# EAGLE design Solar_Charger (EAGLE 9.6.2)
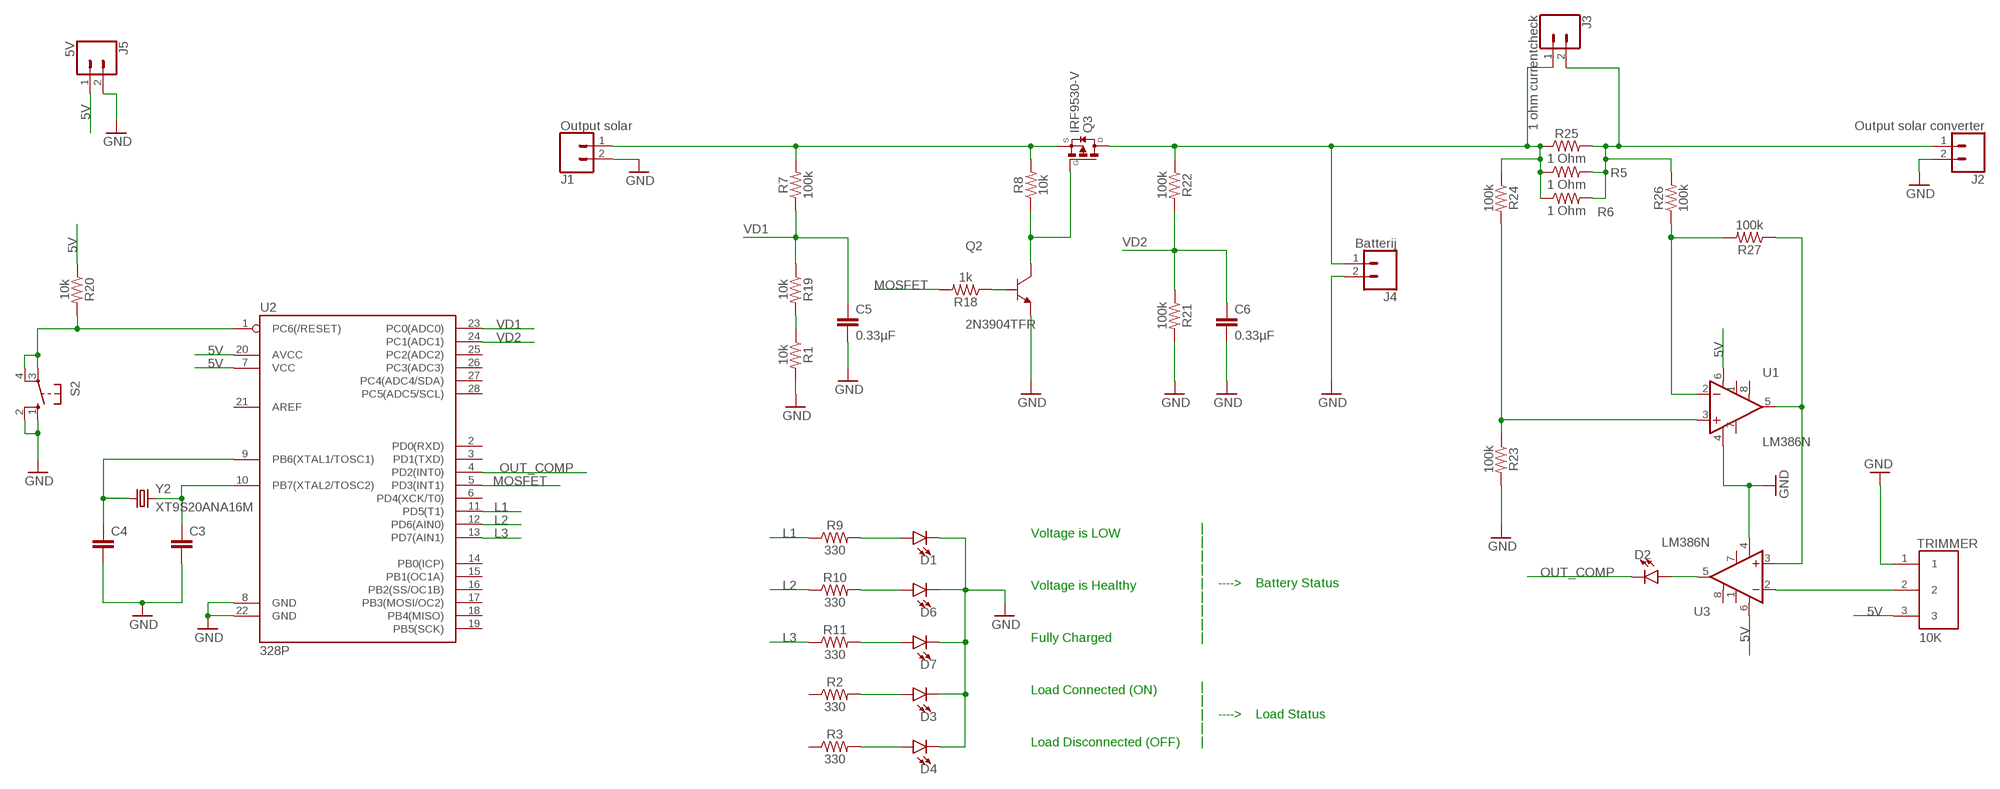
[diagram p0: schematic, sheet 1]

## Parts
C3  C2.5/5  [C2.5-5]
C4  C2.5/5  [C2.5-5]
C5  0.33µF  C2.5/5  [C2.5-5]
C6  0.33µF  C2.5/5  [C2.5-5]
D1  LED-3MM-NO_SILK  [LED_3MM-NS]
D2  LED-3MM-NO_SILK  [LED_3MM-NS]
D3  LED-3MM-NO_SILK  [LED_3MM-NS]
D4  LED-3MM-NO_SILK  [LED_3MM-NS]
D6  LED-3MM-NO_SILK  [LED_3MM-NS]
D7  LED-3MM-NO_SILK  [LED_3MM-NS]
J1  Output solar  CONN_02  [1X02]
J2  Output solar converter  CONN_02  [1X02]
J3  1 ohm currentcheck  CONN_02  [1X02]
J4  Batterij  CONN_02  [1X02]
J5  5V  CONN_02  [1X02]
Q2  2N3904TFR  [TO92254P520H877-3]
Q3  IRF9530-V  [TO220V]
R1  10k  1MOHM-HORIZ-1/4W-5%  [AXIAL-0.3]
R2  330  1KOHM-HORIZ-1/4W-1%  [AXIAL-0.3]
R3  330  1KOHM-HORIZ-1/4W-1%  [AXIAL-0.3]
R5  1 Ohm  1MOHM-HORIZ-1/4W-5%  [AXIAL-0.3]
R6  1 Ohm  1MOHM-HORIZ-1/4W-5%  [AXIAL-0.3]
R7  100k  1MOHM-HORIZ-1/4W-5%  [AXIAL-0.3]
R8  10k  1MOHM-HORIZ-1/4W-5%  [AXIAL-0.3]
R9  330  1KOHM-HORIZ-1/4W-1%  [AXIAL-0.3]
R10  330  1KOHM-HORIZ-1/4W-1%  [AXIAL-0.3]
R11  330  1KOHM-HORIZ-1/4W-1%  [AXIAL-0.3]
R18  1k  1MOHM-HORIZ-1/4W-5%  [AXIAL-0.3]
R19  10k  1MOHM-HORIZ-1/4W-5%  [AXIAL-0.3]
R20  10k  1MOHM-HORIZ-1/4W-5%  [AXIAL-0.3]
R21  100k  1MOHM-HORIZ-1/4W-5%  [AXIAL-0.3]
R22  100k  1MOHM-HORIZ-1/4W-5%  [AXIAL-0.3]
R23  100k  1MOHM-HORIZ-1/4W-5%  [AXIAL-0.3]
R24  100k  1MOHM-HORIZ-1/4W-5%  [AXIAL-0.3]
R25  1 Ohm  1MOHM-HORIZ-1/4W-5%  [AXIAL-0.3]
R26  100k  1MOHM-HORIZ-1/4W-5%  [AXIAL-0.3]
R27  100k  1MOHM-HORIZ-1/4W-5%  [AXIAL-0.3]
S2  10-XX  [B3F-10XX]
TRIMMER  10K  404806347006  [TRIM_404806347006]
U1  LM386N  LM386  [DIP08]
U2  328P  ATMEGA328P_PDIP  [DIP28]
U3  LM386N  LM386  [DIP08]
Y2  XT9S20ANA16M  [XTAL_XT9S20ANA16M]

## Nets
5V: J5.1 R20.P$1 TRIMMER.3 U1.6(V+) U2.7(VCC) U2.20(AVCC) U3.6(V+)
GND: C3.2 C4.2 C5.2 C6.2 D1.K(C) D3.K(C) D4.K(C) D6.K(C) D7.K(C) J1.2 J2.2 J4.2 J5.2 Q2.1(E) R1.P$2 R21.P$2 R23.P$2 S2.1(S) S2.2(S1) TRIMMER.1 U1.4(V-) U2.8(GND) U2.22(GND) U3.4(V-)
GND1: R20.P$2 S2.3(P) S2.4(P1) U2.1(PC6(/RESET))
L1: R9.P$1 U2.11(PD5(T1))
L2: R10.P$1 U2.12(PD6(AIN0))
L3: R11.P$1 U2.13(PD7(AIN1))
MOSFET: R18.P$2 U2.5(PD3(INT1))
N$1: J1.1 Q3.3(S) R7.P$2 R8.P$2
N$2: D3.A R2.P$2
N$3: D4.A R3.P$2
N$4: R23.P$1 R24.P$2 U1.3(+IN)
N$5: R26.P$1 R27.P$2 U1.2(-IN)
N$7: R1.P$1 R19.P$2
N$9: C4.1 U2.9(PB6(XTAL1/TOSC1)) Y2.1
N$10: C3.1 U2.10(PB7(XTAL2/TOSC2)) Y2.2
N$11: Q2.2(B) R18.P$1
N$12: Q2.3(C) Q3.1(G) R8.P$1
N$16: J3.1 J4.1 Q3.2(D) R5.P$1 R6.P$1 R22.P$1 R24.P$1 R25.P$1
N$20: R27.P$1 U1.5(OUT) U3.3(+IN)
N$22: TRIMMER.2 U3.2(-IN)
N$23: D2.A U3.5(OUT)
N$28: J2.1 J3.2 R5.P$2 R6.P$2 R25.P$2 R26.P$2
N$30: D1.A R9.P$2
N$31: D6.A R10.P$2
N$32: D7.A R11.P$2
OUT_COMP: D2.K(C) U2.4(PD2(INT0))
VD1: C5.1 R7.P$1 R19.P$1 U2.23(PC0(ADC0))
VD2: C6.1 R21.P$1 R22.P$2 U2.24(PC1(ADC1))
Unconnected: R2.P$1 R3.P$1 U1.1(GAIN) U1.7(BP) U1.8(GAIN) U2.2(PD0(RXD)) U2.3(PD1(TXD)) U2.6(PD4(XCK/T0)) U2.14(PB0(ICP)) U2.15(PB1(OC1A)) U2.16(PB2(SS/OC1B)) U2.17(PB3(MOSI/OC2)) U2.18(PB4(MISO)) U2.19(PB5(SCK)) U2.21(AREF) U2.25(PC2(ADC2)) U2.26(PC3(ADC3)) U2.27(PC4(ADC4/SDA)) U2.28(PC5(ADC5/SCL)) U3.1(GAIN) U3.7(BP) U3.8(GAIN)

## Notes on the sheet
- Voltage is LOW
- Voltage is Healthy
- Fully Charged
- |
  |
  |
  |
  |    ---->    Battery Status
  |
  |
  |
  |
- Load Connected (ON)
- Load Disconnected (OFF)
- |
  |
  |    ---->    Load Status
  |
  |

## Library data of the parts
C3-C6 = capacitor-wima:C: CAPACITOR naming: grid - package width
D1-D4 D6 D7 = SparkFun-LED:LED: LED (Generic) Standard schematic elements and footprints for 5mm, 3mm, 1206, and 0603 sized LEDs. Generic LEDs with no color specified.
J1-J5 = SparkFun-Connectors:CONN_02: Multi connection point. Often used as Generic Header-pin footprint for 0.1 inch spaced/style header connections On any of the 0.1 inch spaced packages, you can populate with these: Break Away Headers - Straight <https://www.sparkfun.com/products/116> (PRT-00116) Break Away Male Headers - Right Angle <https://www.sparkfun.com/products/553> (PRT-00553) Female Headers <https://www.sparkfun.com/products/115> (PRT-00115) Break Away Headers - Machine Pin <https://www.sparkfun.com/products/117> (PRT-00117) Break Away Female Headers - Swiss Machine Pin <https://www.sparkfun.com/products/743> (PRT-00743) For SCREWTERMINALS and SPRING TERMINALS visit here: Screw Terimnals on SparkFun.com <https://www.sparkfun.com/search/results?term=Screw+Terminals> (5mm/3.5mm/2.54mm spacing) This device is also useful as a general connection point to wire up your design to another part of your project. Our various solder wires solder well into these plated through hole pads. Hook-Up Wire - Assortment (Stranded, 22 AWG) <https://www.sparkfun.com/products/11375> (PRT-11375) Hook-Up Wire - Assortment (Solid Core, 22 AWG) <https://www.sparkfun.com/products/11367> (PRT-11367) View the entire wire category on our website here <https://www.sparkfun.com/categories/141> Special notes: Molex polarized connector foot print use with: PRT-08233 with associated crimp pins and housings. 2.54_SCREWTERM for use with PRT-10571. 3.5mm Screw Terminal footprints for PRT-08084 5mm Screw Terminal footprints for use with PRT-08432
Q2 = 2N3904TFR:2N3904TFR: Transistor General Purpose BJT NPN 40 Volt 0.2 Amp 3-Pin TO-92 Tape And Reel; AVAILABILITY: Unavailable; DESCRIPTION: Transistor General Purpose BJT NPN 40 Volt 0.2 Amp 3-Pin TO-92 Tape And Reel; MF: ON Semiconductor; MP: 2N3904TFR; PACKAGE: TO-92 ON Semiconductor; PRICE: None
Q3 = IRF9530:IRF9530: P-Channel MOSFET (HEXFET); -100V; -12A; 0,3Ohm; AVAILABILITY: Unavailable; DESCRIPTION: Trans MOSFET P-CH 100V 12A 3-Pin_3+Tab_ TO-220AB; MF: Vishay; MP: IRF9530; PACKAGE: TO-220 Intersil; PRICE: None
R1 R5-R8 R18-R27 = SparkFun-Resistors:1MOHM: 1MΩ resistor A resistor is a passive two-terminal electrical component that implements electrical resistance as a circuit element. Resistors act to reduce current flow, and, at the same time, act to lower voltage levels within circuits. - Wikipedia; PROD_ID: RES-09329; VALUE: 1M
R2 R3 R9-R11 = SparkFun-Resistors:1KOHM: 1kΩ resistor A resistor is a passive two-terminal electrical component that implements electrical resistance as a circuit element. Resistors act to reduce current flow, and, at the same time, act to lower voltage levels within circuits. - Wikipedia; PROD_ID: RES-12182; VALUE: 1k
S2 = switch-omron:10-XX: OMRON SWITCH; MPN: B3F-1000; OC_FARNELL: 176432; OC_NEWARK: 36M3542
TRIMMER = 404806347006:404806347006: Res Cermet Trimmer 500 Ohm 10% 1/2W 1Turn Pin Thru-Hole; AVAILABILITY: Unavailable; COMMENT: 1623831-6; DESCRIPTION: Res Cermet Trimmer 500 Ohm 10% 1/2W 1Turn Pin Thru-Hole; MF: TE Connectivity; MP: 404806347006; PACKAGE: 6332 TE Connectivity; PRICE: None; TE_PURCHASE_URL: https://www.te.com/usa-en/product-1623831-6.html?te_bu=Cor&te_type=disp&te_campaign=seda_glo_cor-seda-global-disp-prtnr-fy19-seda-model-bom-cta_sma-317_1&elqCampaignId=32493
U1 U3 = SparkFun-IC-Amplifiers:LM386: low voltage audio power amplifier SparkFun Products FabFM Radio Kit <https://www.sparkfun.com/products/11043> (KIT-11043); PROD_ID: IC-10899
U2 = SparkFun-IC-Microcontroller:ATMEGA328P_PDIP: Atmel 328P Through hole ATMEGA328P uC used in the Arduino 32kb flash, 1k EEPROM, 2k SRAM Datasheet <http://www.sparkfun.com/datasheets/Components/SMD/ATMega328.pdf> SparkFun Products Storefront component: AVR 28 Pin 20MHz 32K 6A/D - ATMega328P <https://www.sparkfun.com/products/9061> (COM-09061) SparkFun Simon Says - Through-Hole Soldering Kit <https://www.sparkfun.com/products/10547> (KIT-10547) SparkFun Learn to Solder - Simon Says <https://www.sparkfun.com/products/13708> (KIT-13708) SparkFun BigTime Watch Kit <https://www.sparkfun.com/products/11734> (KIT-11734) SparkFun ClockIt <https://www.sparkfun.com/products/10930> (KIT-10930) SparkFun Serial Enabled LCD Kit <https://www.sparkfun.com/products/10097> (LCD-10097) SparkFun Simon Tilts - Through Hole Soldering Kit <https://www.sparkfun.com/products/12634> (KIT-12634) SparkFun Frequency Counter Kit <https://www.sparkfun.com/products/10140> (KIT-10140) FabFM Radio Kit <https://www.sparkfun.com/products/11043> (KIT-11043) SparkFun Binary Blaster Kit <https://www.sparkfun.com/products/12037> (KIT-12037) SparkFun Metro-Gnome <https://www.sparkfun.com/products/9236> (KIT-09236) ATmega328 with Arduino Optiboot (Uno) <https://www.sparkfun.com/products/10524> (DEV-10524); PROD_ID: IC-09136
Y2 = XT9S20ANA16M:XT9S20ANA16M: Microprocessor, Crystal; 16 MHz; + 30 ppm (Typ.) @ 25 degC; 7 pF (Max.); 40 Ohm; AVAILABILITY: Unavailable; DESCRIPTION: Oscillator; Crystal; 16MHz; Miniature; TH; +/-30ppm; -20 to +70ppm; 40 Ohms; Fund.; 20pF; MF: Vishay; MP: XT9S20ANA16M; PACKAGE: None; PRICE: None

## Board
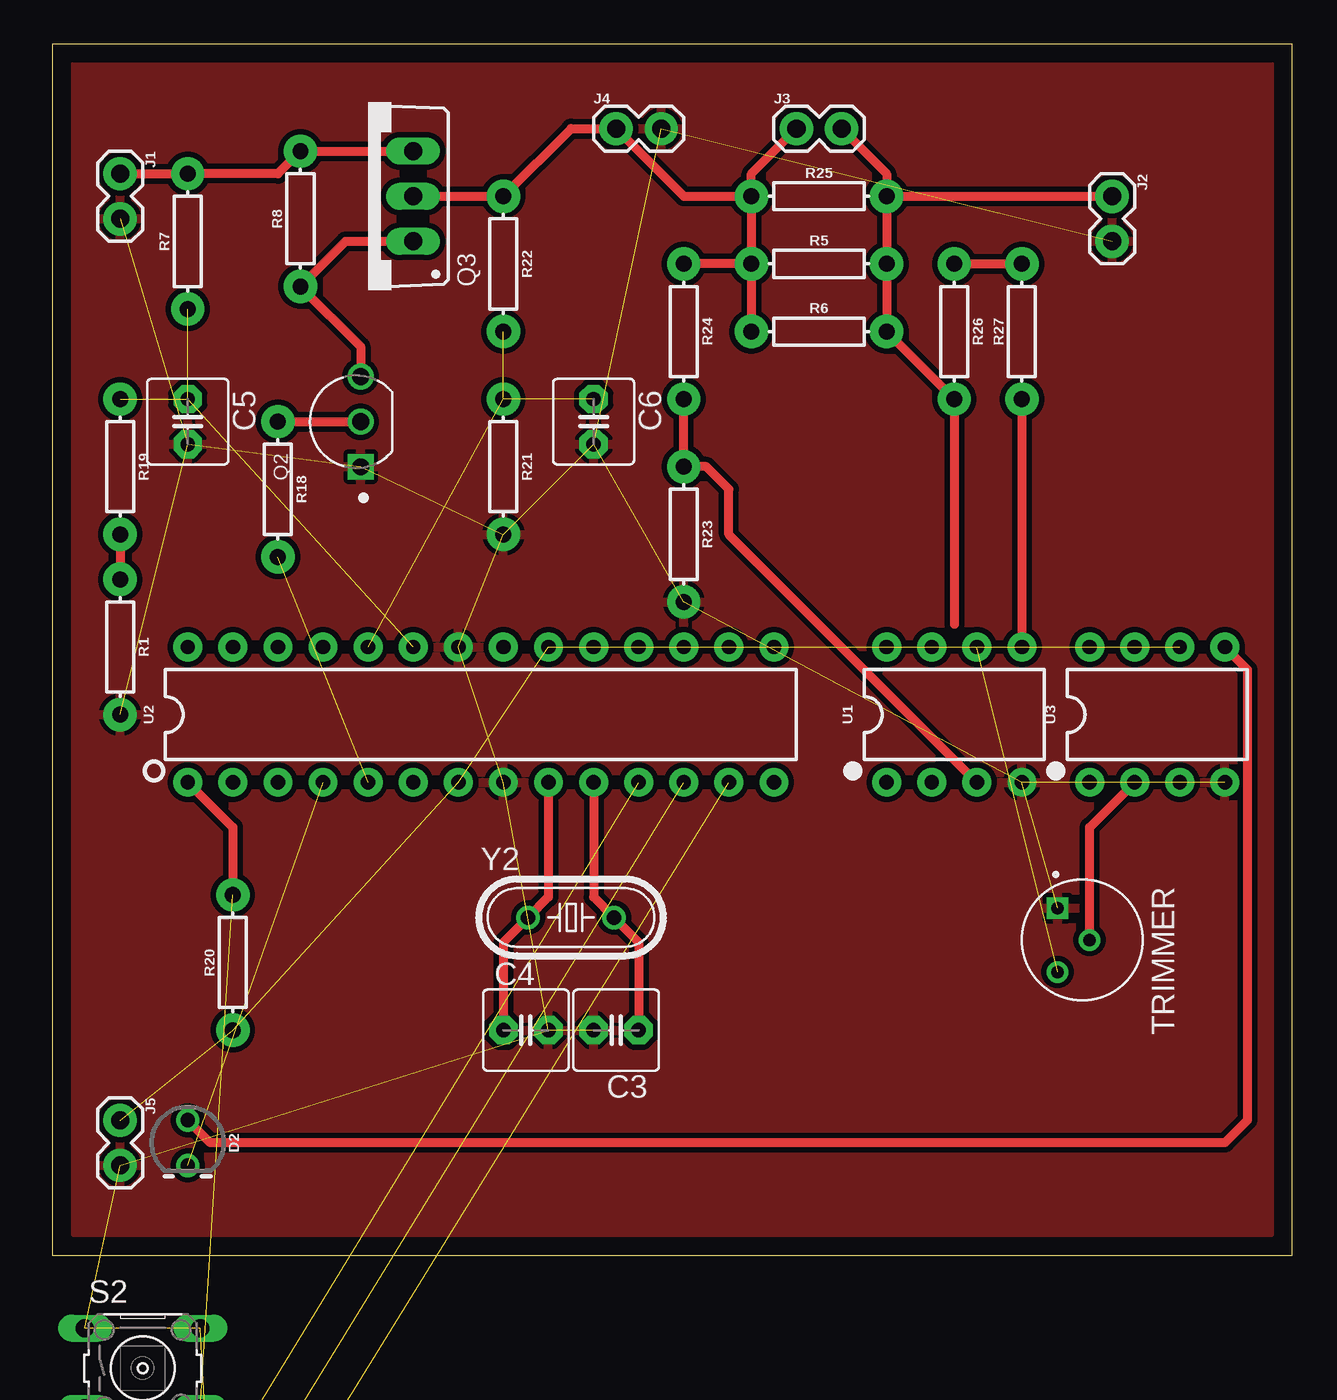
[diagram p1: board, top side]
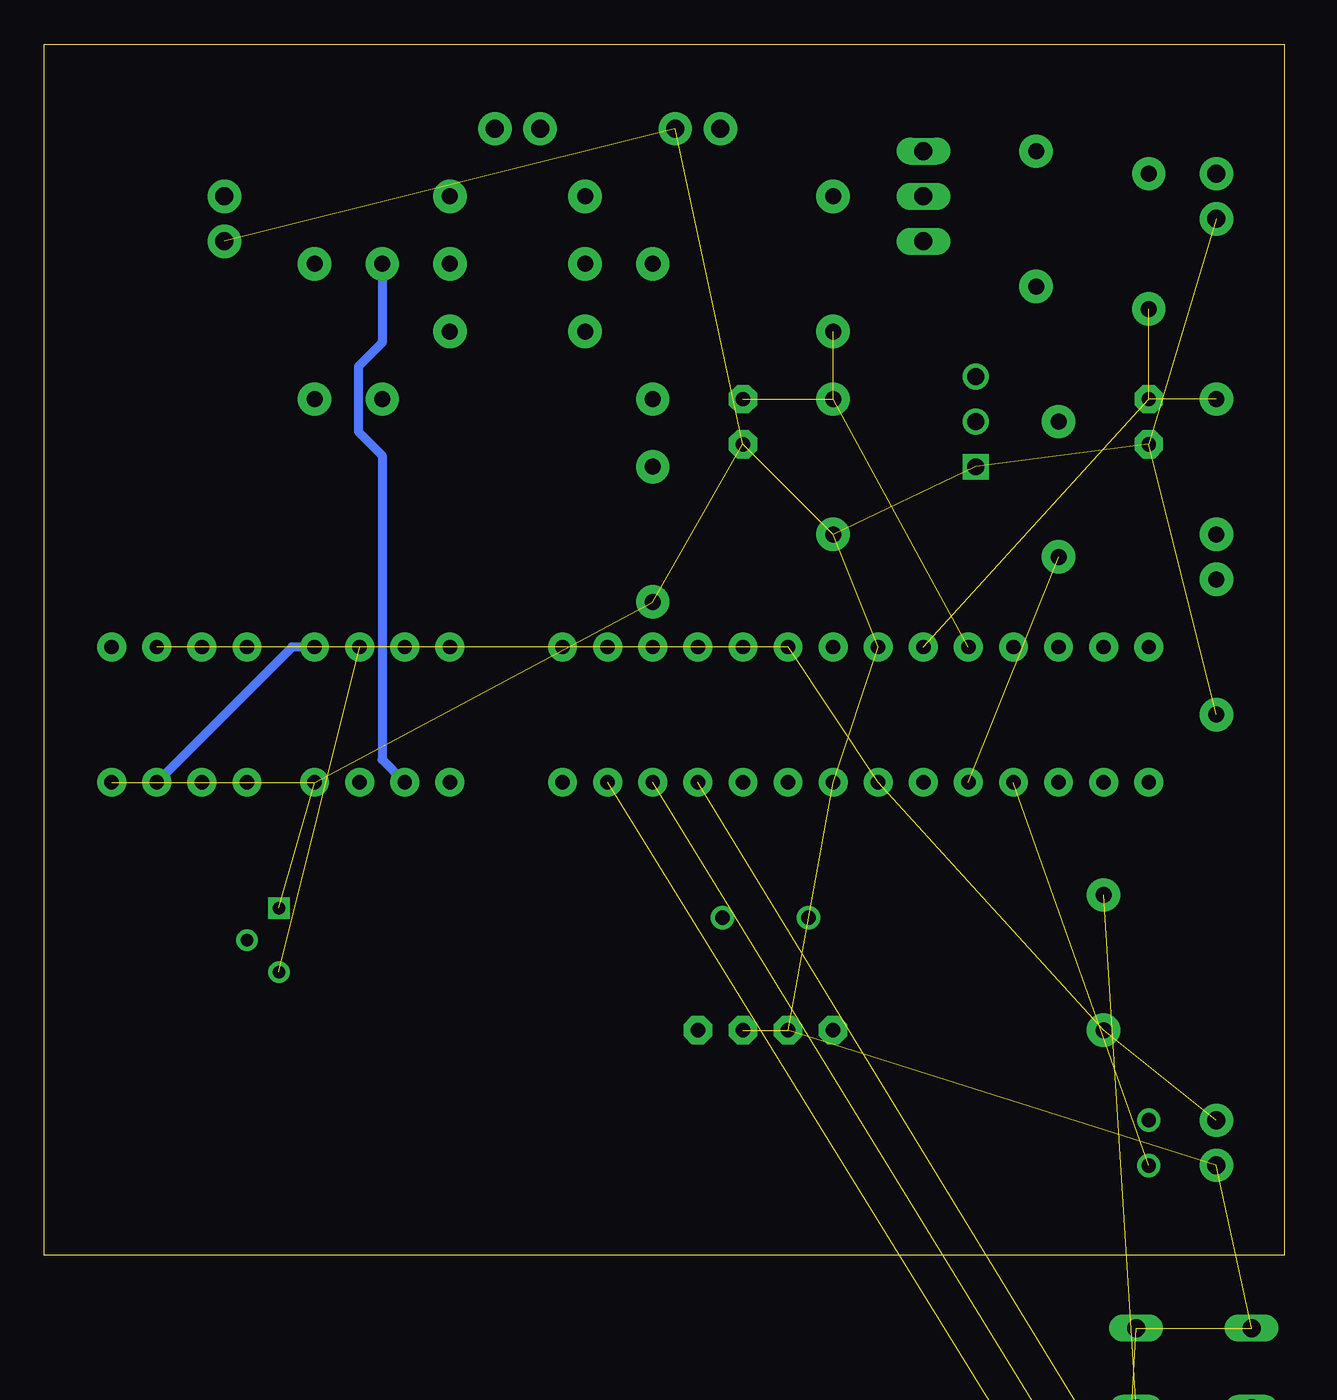
[diagram p2: board, bottom side, seen from below]

Size 69.83 x 68.25 mm. Coordinates in mm from the lower left corner, seen from the top.
Outline: 0,0 69.83,0 69.83,68.25 0,68.25 0,0
Copper layers (1*16): Top 0.035mm / dielectric 1.5mm / Bottom 0.035mm
Design rules "default": minimum track width 6mil, minimum drill 0.35mm, track to track 6mil, track to pad 6mil, pad to pad 6mil, via to via 6mil, smd to smd 6mil, copper to edge 40mil, drill to drill 6mil, minimum pad ring 10mil, minimum via ring 8mil, stop-mask expansion 4mil, vias tented up to drill 0mil, thermal gap 10mil

### Footprints (pad centres in the part's own frame; a part is rotated, then mirrored left to right if it is on the bottom)
C2.5-5 = drill 0.813 pad 1.6 octagon: 1 -1.27,0; 2 1.27,0
LED_3MM-NS = drill 0.813: A -1.27,0; K 1.27,0
1X02 = drill 1.016 pad 1.88: 1 0,0; 2 2.54,0
TO92254P520H877-3 = drill 0.94 pad 1.41 square: 1 -2.54,-0.853 | drill 0.94 pad 1.41: 2 0,-0.853; 3 2.54,-0.853
TO220V = drill 1.016 long: 1 -2.54,-2.54; 2 0,-2.54; 3 2.54,-2.54
AXIAL-0.3 = drill 0.9 pad 1.88: P$1 -3.81,0; P$2 3.81,0
B3F-10XX = drill 1.016 long: 1 -3.251,2.261; 2 3.251,2.261; 3 -3.251,-2.261; 4 3.251,-2.261
TRIM_404806347006 = drill 0.7 pad 1.1 square: 1 -1.8,-1.8 | drill 0.7 pad 1.1: 2 0,0; 3 1.8,-1.8
DIP08 = drill 0.813 pad 1.626: 1 -3.81,-3.81; 2 -1.27,-3.81; 3 1.27,-3.81; 4 3.81,-3.81; 5 3.81,3.81; 6 1.27,3.81; 7 -1.27,3.81; 8 -3.81,3.81
DIP28 = drill 0.813 pad 1.626: 1 -16.51,-3.81; 2 -13.97,-3.81; 3 -11.43,-3.81; 4 -8.89,-3.81; 5 -6.35,-3.81; 6 -3.81,-3.81; 7 -1.27,-3.81; 8 1.27,-3.81; 9 3.81,-3.81; 10 6.35,-3.81; 11 8.89,-3.81; 12 11.43,-3.81; 13 13.97,-3.81; 14 16.51,-3.81; 15 16.51,3.81; 16 13.97,3.81; 17 11.43,3.81; 18 8.89,3.81; 19 6.35,3.81; 20 3.81,3.81; 21 1.27,3.81; 22 -1.27,3.81; 23 -3.81,3.81; 24 -6.35,3.81; 25 -8.89,3.81; 26 -11.43,3.81; 27 -13.97,3.81; 28 -16.51,3.81
XTAL_XT9S20ANA16M = drill 0.813: 1 -2.413,0; 2 2.413,0

### Placement (x,y rotation side)
C3  31.75,12.7 180 top
C4  26.67,12.7 0 top
C5  7.62,46.99 270 top
C6  30.48,46.99 270 top
D1  2.54,-13.97 0 top  (outside the outline)
D2  7.62,6.35 270 top
D3  2.54,-38.1 0 top  (outside the outline)
D4  7.62,-38.1 0 top  (outside the outline)
D6  7.62,-13.97 0 top  (outside the outline)
D7  2.54,-20.32 0 top  (outside the outline)
J1  3.81,60.96 270 top
J2  59.69,59.69 270 top
J3  41.91,63.5 0 top
J4  31.75,63.5 0 top
J5  3.81,7.62 270 top
Q2  16.51,46.99 90 top
Q3  17.78,59.69 90 top
R1  3.81,34.29 270 top
R2  5.08,-43.18 0 top  (outside the outline)
R3  5.08,-46.99 0 top  (outside the outline)
R5  43.18,55.88 0 top
R6  43.18,52.07 0 top
R7  7.62,57.15 90 top
R8  13.97,58.42 90 top
R9  5.08,-25.4 0 top  (outside the outline)
R10  5.08,-29.21 0 top  (outside the outline)
R11  5.08,-33.02 0 top  (outside the outline)
R18  12.7,43.18 270 top
R19  3.81,44.45 270 top
R20  10.16,16.51 90 top
R21  25.4,44.45 270 top
R22  25.4,55.88 270 top
R23  35.56,40.64 270 top
R24  35.56,52.07 270 top
R25  43.18,59.69 0 top
R26  50.8,52.07 270 top
R27  54.61,52.07 90 top
S2  5.08,-6.35 0 top  (outside the outline)
TRIMMER  58.42,17.78 270 top
U1  50.8,30.48 0 top
U2  24.13,30.48 0 top
U3  62.23,30.48 0 top
Y2  29.21,19.05 0 top

### Tracks (layer width: path | path; a pad name or v marks a point on that pad's centre or on a via)
5V  (6 unrouted)
GND  (23 unrouted)
  pour Top (isolate 0.305): 1.27,67.31 68.58,67.31 68.58,1.27 1.27,1.27
GND1  (2 unrouted)
  Top 0.508: U2.1 10.16,24.13 R20.P$2
L1  (1 unrouted)
L2  (1 unrouted)
L3  (1 unrouted)
MOSFET  (1 unrouted)
N$1
  Top 0.508: J1.1 R7.P$2 12.7,60.96 R8.P$2 Q3.3
N$2  (1 unrouted)
N$3  (1 unrouted)
N$4
  Top 0.508: U1.3 38.1,40.64 38.1,43.18 36.83,44.45 R23.P$1 R24.P$2
N$5
  Top 0.508: R26.P$1 R27.P$2
  Bottom 0.508: U1.2 50.8,27.94 50.8,45.09 52.15,46.43 52.15,50.09 50.8,51.43 R26.P$1
N$7
  Top 0.508: R19.P$2 R1.P$1
N$9
  Top 0.508: U2.9 27.94,20.19 Y2.1 25.4,17.65 C4.1
N$10
  Top 0.508: U2.10 30.48,20.19 Y2.2 33.02,17.65 C3.1
N$11
  Top 0.508: R18.P$1 Q2.2
N$12
  Top 0.508: Q3.1 16.51,57.15 R8.P$1 17.36,51.22 Q2.3
N$16
  Top 0.508: Q3.2 R22.P$1 29.21,63.5 J4.1 35.56,59.69 R25.P$1 | R25.P$1 39.37,60.96 J3.1 | R25.P$1 R5.P$1 | R5.P$1 R6.P$1 | R5.P$1 R24.P$1
N$20
  Top 0.508: R27.P$1 U1.5
  Bottom 0.508: U1.5 55.88,34.29 U3.3
N$22
  Top 0.508: TRIMMER.2 58.42,24.13 U3.2
N$23
  Top 0.508: U3.5 67.31,33.02 67.31,7.62 66.04,6.35 8.89,6.35 D2.A
N$28
  Top 0.508: J3.2 46.99,60.96 R25.P$2 | R25.P$2 R5.P$2 R6.P$2 R26.P$2 50.8,35.56 | R25.P$2 J2.1
N$30  (1 unrouted)
N$31  (1 unrouted)
N$32  (1 unrouted)
OUT_COMP  (1 unrouted)
VD1  (3 unrouted)
VD2  (3 unrouted)